# Altium project ROGO_ALFA_FULL_V2I2.PrjPcb
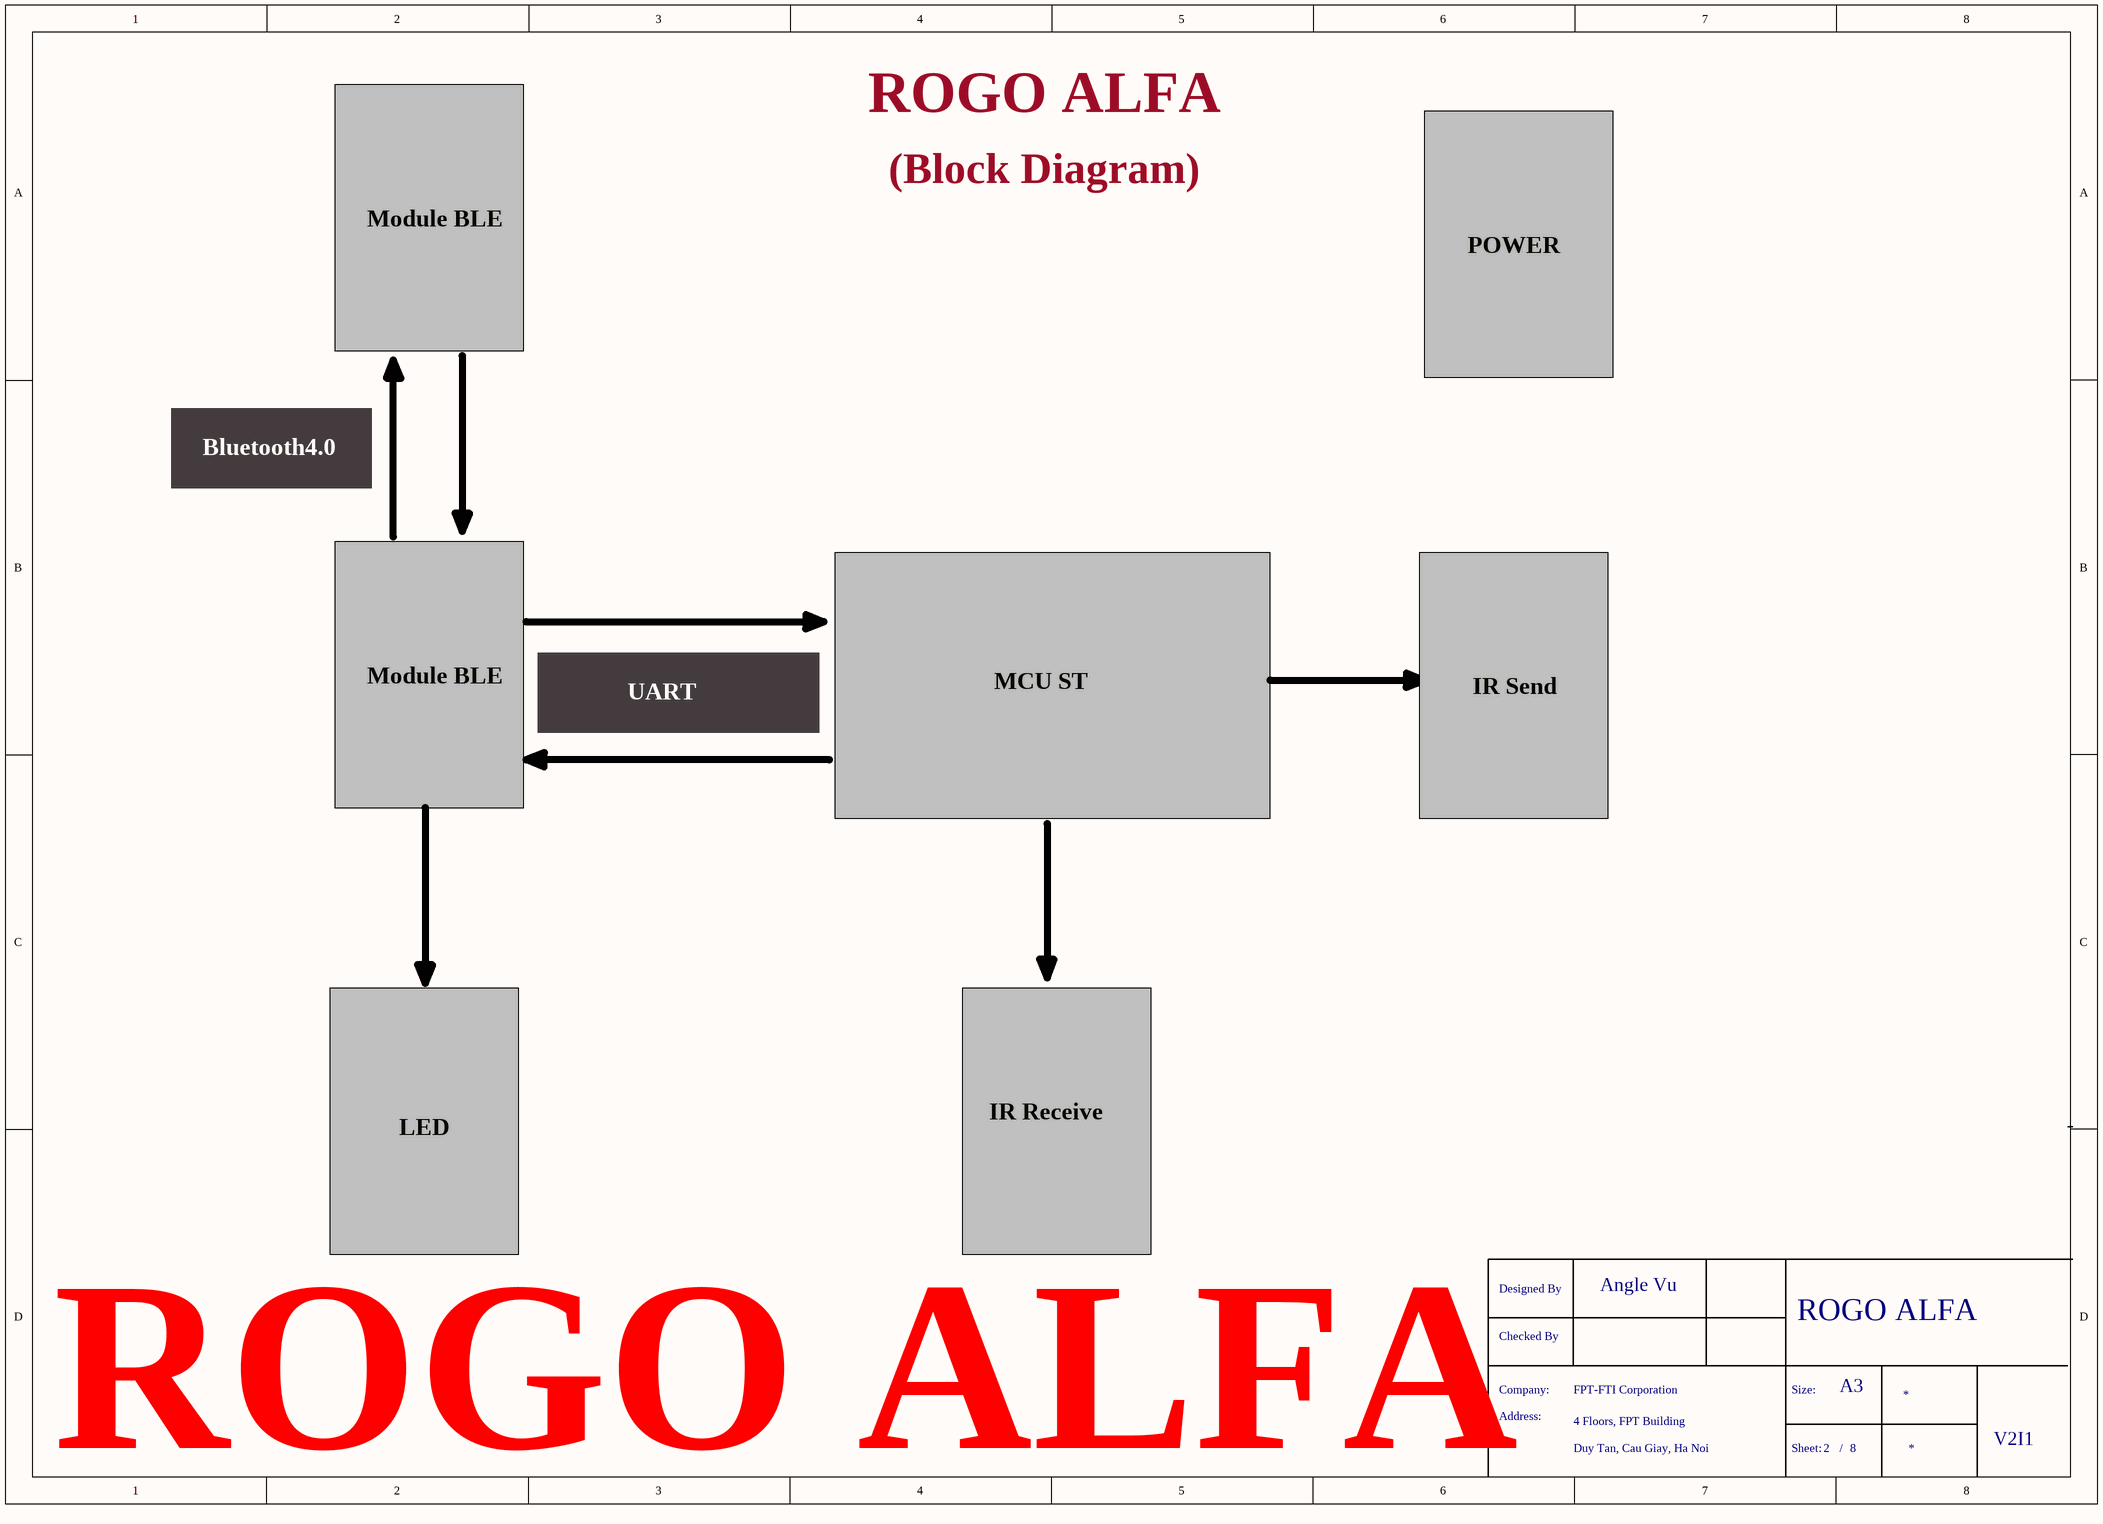
[diagram p0: [02] - BLOCK DIAGRAM.SchDoc]
addressName1: 4 Floors, FPT Building; addressName2: Duy Tan, Cau Giay, Ha Noi; CName: FPT-FTI Corporation; NameProject: ROGO ALFA; Version: V2I1
4 sheets, 54 parts. Net scope: flat (ports and power ports of the same name join across sheets).
Board file: ROGO_ALFA_FULL_PCB_V2I2 .PcbDoc
Sheets:
  [02] - BLOCK DIAGRAM.SchDoc
  [03] - MODULE BLE.SchDoc
  [05] - POWER.SchDoc
  [06] - PERIPHERAL.SchDoc

## Sheet [02] - BLOCK DIAGRAM.SchDoc
size A3; DocumentNumber: 2; SheetNumber: 2; SheetTotal: 8; NameAuthor: Angle Vu

### Notes on the sheet
- Module BLE
- (Block Diagram)
- POWER
- Bluetooth4.0
- UART
- MCU ST
- IR Send
- IR Receive
- LED
- CLOCKS (CPU & PCIE)
- ROGO ALFA
- Designed By
- Checked By
- Company:
- Size:
- A3
- Address:
- Sheet:
- /

## Sheet [03] - MODULE BLE.SchDoc
size A3; CompanyName: FPT-FTI copporation; Address1: FPT Building Duy Tan; Address2: Floor 4,; DocumentNumber: 3; SheetNumber: 3; SheetTotal: 8; NameAuthor: Angle Vu
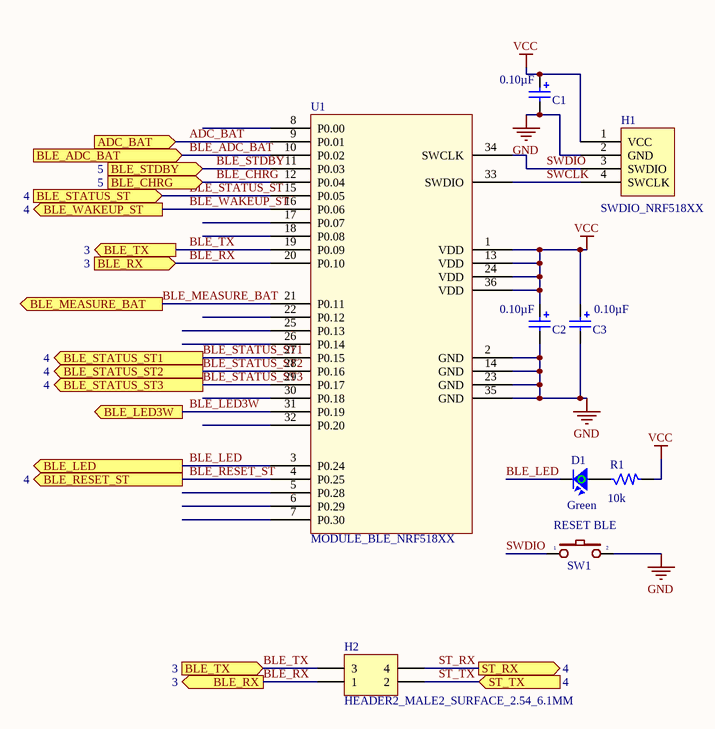
[diagram p1: [03] - MODULE BLE.SchDoc]

### Parts
C1  Capacitance: 0.10µF  [CAP_SMD0603]  (hidden comment: C_104_0603_CERAMIC_16V)
C2  Capacitance: 0.10µF  [CAP_SMD0603]  (hidden comment: C_104_0603_CERAMIC_16V)
C3  Capacitance: 0.10µF  [CAP_SMD0603]  (hidden comment: C_104_0603_CERAMIC_16V)
D1  Color: Green  [LED_GREEN_SMD0603]  (hidden comment: LED2_GREEN_0603_2V)
H1  SWDIO_NRF518XX  [HEADER4_ISP_NRF518xx_SUR1.27]
H2  HEADER2_MALE2_SURFACE_2.54_6.1MM  [HEADER2_MALE2_SUR2.54]
R1  Resistance (Ohms): 10k  [RES_SMD0603]  (hidden comment: R_10K_SMD0603_1%_1/10W)
SW1  RESET BLE  [SW2-SMD]
U1  MODULE_BLE_NRF518XX  [MODULE_NRF518xx]

### Ports
ADC_BAT (in), BLE_ADC_BAT (in), BLE_CHRG (in, see 5), BLE_LED3W (out), BLE_LED (out), BLE_MEASURE_BAT (out), BLE_RESET_ST (out, see 4), BLE_RX (in, see 3), BLE_RX (out, see 3), BLE_STATUS_ST1 (out, see 4), BLE_STATUS_ST2 (out, see 4), BLE_STATUS_ST3 (out, see 4), BLE_STATUS_ST (in, see 4), BLE_STDBY (in, see 5), BLE_TX (in, see 3), BLE_TX (out, see 3), BLE_WAKEUP_ST (out, see 4), ST_RX (out, see 4), ST_TX (in, see 4)

### Nets
GND: C1.2 C2.2 C3.2 H1.2(GND) SW1.2 U1.2(GND) U1.14(GND) U1.23(GND) U1.35(GND)
VCC: C1.1 C2.1 C3.1 H1.1(VCC) R1.2 U1.1(VDD) U1.13(VDD) U1.24(VDD) U1.36(VDD)
ADC_BAT: U1.9(P0.01) ; port ADC_BAT
BLE_ADC_BAT: U1.10(P0.02) ; port BLE_ADC_BAT
BLE_CHRG: U1.12(P0.04) ; port BLE_CHRG
BLE_LED: D1.2 U1.3(P0.24) ; port BLE_LED
BLE_LED3W: U1.31(P0.19) ; port BLE_LED3W
BLE_MEASURE_BAT: U1.21(P0.11) ; port BLE_MEASURE_BAT
BLE_RESET_ST: U1.4(P0.25) ; port BLE_RESET_ST
BLE_RX: H2.1 U1.20(P0.10) ; port BLE_RX
BLE_STATUS_ST: U1.15(P0.05) ; port BLE_STATUS_ST
BLE_STATUS_ST1: U1.27(P0.15) ; port BLE_STATUS_ST1
BLE_STATUS_ST2: U1.28(P0.16) ; port BLE_STATUS_ST2
BLE_STATUS_ST3: U1.29(P0.17) ; port BLE_STATUS_ST3
BLE_STDBY: U1.11(P0.03) ; port BLE_STDBY
BLE_TX: H2.3 U1.19(P0.09) ; port BLE_TX
BLE_WAKEUP_ST: U1.16(P0.06) ; port BLE_WAKEUP_ST
ST_RX: H2.4 ; port ST_RX
ST_TX: H2.2 ; port ST_TX
SWCLK: H1.4(SWCLK) U1.33(SWDIO)
SWDIO: H1.3(SWDIO) SW1.1 U1.34(SWCLK)
NetD1_1: D1.1 R1.1

Not connected (* = marked no-connect by the designer): U1 5(P0.28) 6(P0.29) 7(P0.30) 8(P0.00) 17(P0.07) 18(P0.08) 22(P0.12) 25(P0.13) 26(P0.14) 30(P0.18) 32(P0.20)

### Notes on the sheet
- Designed By
- Checked By
- Company:
- Size:
- A3
- Address:
- Sheet:
- /

### Library data of the parts
C1-C3 = C_104_0603_CERAMIC_16V: CAP CER 0.1UF 16V X7R 0603; Manufacturer: Murata Electronics North America; Manufacturer Part Number: GRM188R71C104KA01D; Tolerance: ±10%; Supplier 1: Digi-Key; RoHS: RoHS Compliant; Category: Capacitors; Stock 1: 3132000; Pricing 1: 4000=0.00359, 8000=0.00328, 12000=0.00312, 28000=0.00296, 100000=0.00215 (USD); Packaging: Tape & Reel (TR); Part Status: Active; Voltage - Rated: 16V; Temperature Coefficient: X7R; Mounting Type: Surface Mount, MLCC; Operating Temperature: -55°C ~ 125°C; Applications: General Purpose; Ratings: -; Package / Case: 0603 (1608 Metric); Size / Dimension: 0.063" L x 0.031" W (1.60mm x 0.80mm); Height - Seated (Max): -; Thickness (Max): 0.035" (0.90mm); Lead Spacing: -; Features: -; Lead Style: -; ComponentLink1URL: http://www.murata.com/~/media/webrenewal/support/library/catalog/products/capacitor/mlcc/c02e.pdf; ComponentLink1Description: http://www.murata.com/~/media/webrenewal/support/library/catalog/products/capacitor/mlcc/c02e.pdf; Supplier Part Number 1: 490-1532-2-ND
D1 = LED2_GREEN_0603_2V: LED GREEN CLEAR 0603 SMD; Manufacturer: Lite-On Inc.; Manufacturer Part Number: LTST-C191KGKT; Lens Color: Colorless; Millicandela Rating: 35mcd; Lens Style/Size: Rectangle with Flat Top, 1.10mm x 0.80mm; Voltage - Forward (Vf) (Typ): 2V; Current - Test: 20mA; Viewing Angle: 130°; Wavelength - Dominant: 571nm; Wavelength - Peak: 574nm; Supplier 1: Digi-Key; RoHS: RoHS Compliant; Category: Optoelectronics; Stock 1: 960000; Pricing 1: 5000=0.0404, 10000=0.03636, 25000=0.03232, 50000=0.02929, 125000=0.02727 (USD); Packaging: Tape & Reel (TR); Part Status: Active; Lens Transparency: Clear; Mounting Type: Surface Mount; Features: -; Package / Case: 0603 (1608 Metric); Supplier Device Package: *; Size / Dimension: 1.60mm L x 0.80mm W; Height (Max): 0.55mm; ComponentLink1URL: http://optoelectronics.liteon.com/upload/download/DS22-2000-228/S_110_LTST-C191KGKT.pdf; ComponentLink1Description: http://optoelectronics.liteon.com/upload/download/DS22-2000-228/S_110_LTST-C191KGKT.pdf; Supplier Part Number 1: 160-1446-2-ND
H1 = HEADER4_ISP_NRF518XX_HOLE_2.54: CONN HEADER 4POS .100 STR TIN; Manufacturer: Amphenol FCI; Manufacturer Part Number: 68002-404HLF; Connector Type: Header, Unshrouded; Number of Positions: 4; Number of Positions Loaded: All; Pitch: 0.100" (2.54mm); Supplier 1: Digi-Key; RoHS: RoHS Compliant; Category: Connectors, Interconnects; Stock 1: 5773; Pricing 1: 1=0.2, 10=0.186, 25=0.1588, 100=0.129, 250=0.11408, 500=0.10912, 1000=0.08928, 2500=0.08184, 5000=0.07936 (USD); Packaging: Bulk; Part Status: Active; Contact Type: Male Pin; Number of Rows: 1; Row Spacing: -; Contact Mating Length: 0.230" (5.84mm); Mounting Type: Through Hole; Termination: Solder; Fastening Type: -; Features: -; Contact Finish: Tin; Contact Finish Thickness: 100µin (2.54µm); Color: Black; ComponentLink1URL: http://portal.fciconnect.com/Comergent//fci/drawing/68000.pdf; ComponentLink1Description: http://portal.fciconnect.com/Comergent//fci/drawing/68000.pdf; Supplier Part Number 1: 609-3305-ND
H2 = HEADER2_MALE2_SURFACE_2.54_6.1MM: CONN HEADER 4POS TIN SMD; Manufacturer: Molex, LLC; Manufacturer Part Number: 0015912040; Connector Type: Header, Unshrouded, Breakaway; Number of Positions: 4; Number of Positions Loaded: All; Pitch: 0.100" (2.54mm); Supplier 1: Digi-Key; RoHS: RoHS Compliant; Category: Connectors, Interconnects; Stock 1: 10914; Pricing 1: 1=0.44, 10=0.42, 25=0.3596, 50=0.3058, 100=0.2938, 250=0.2638, 500=0.2518, 1000=0.20983, 2500=0.19184 (USD); Packaging: Bulk; Part Status: Active; Contact Type: Male Pin; Number of Rows: 2; Row Spacing: 0.100" (2.54mm); Contact Mating Length: 0.240" (6.10mm); Mounting Type: Surface Mount; Termination: Solder; Fastening Type: -; Features: -; Contact Finish: Tin; Contact Finish Thickness: 150µin (3.81µm); Color: Black; ComponentLink1URL: http://www.molex.com/pdm_docs/sd/015912040_sd.pdf; ComponentLink1Description: http://www.molex.com/pdm_docs/sd/015912040_sd.pdf; Supplier Part Number 1: WM9514-ND; ComponentLink2URL: http://www.te.com/commerce/DocumentDelivery/DDEController?Action=srchrtrv&DocNm=640456&DocType=Customer+Drawing&DocLang=English; ComponentLink2Description: http://www.te.com/commerce/DocumentDelivery/DDEController?Action=srchrtrv&DocNm=640456&DocType=Customer+Drawing&DocLang=English
R1 = R_10K_SMD0603_1%_1/10W: RES SMD 10K OHM 1% 1/10W 0603; Manufacturer: Yageo; Manufacturer Part Number: RC0603FR-0710KL; Power (Watts): 0.1W, 1/10W; Temperature Coefficient: ±100ppm/°C; Capacitance: 0.10µF; Voltage - Rated: 50V; Supplier 1: Digi-Key; RoHS: RoHS Compliant; Category: Resistors; Stock 1: 10005000; Pricing 1: 5000=0.00167, 10000=0.00145, 25000=0.00128, 50000=0.00117, 125000=0.00115 (USD); Packaging: Tape & Reel (TR); Part Status: Active; Tolerance: ±1%; Composition: Thick Film; Features: Moisture Resistant; Operating Temperature: -55°C ~ 155°C; Package / Case: 0603 (1608 Metric); Supplier Device Package: 0603; Size / Dimension: 0.063" L x 0.031" W (1.60mm x 0.80mm); Height: 0.022" (0.55mm); Number of Terminations: 2; ComponentLink1URL: http://www.yageo.com/documents/recent/PYu-RC_Group_51_RoHS_L_04.pdf; ComponentLink1Description: http://www.yageo.com/documents/recent/PYu-RC_Group_51_RoHS_L_04.pdf; Supplier Part Number 1: 311-10.0KHRTR-ND; Mounting Type: Surface Mount, MLCC; Applications: General Purpose; Ratings: -; Height - Seated (Max): -; Thickness (Max): 0.037" (0.94mm); Lead Spacing: -; Lead Style: -; ComponentLink2URL: http://datasheets.avx.com/X7RDielectric.pdf; ComponentLink2Description: http://datasheets.avx.com/X7RDielectric.pdf
SW1 = SW2_DPST_SURFACE_5MM: SWITCH TACTILE SPST-NO 0.05A 12V; Manufacturer: Wurth Electronics Inc; Manufacturer Part Number: 434121050836; Switch Function: Off-Mom; Contact Rating @ Voltage: 0.05A @ 12VDC; Actuator Type: Rectangular Button; Actuator Height off PCB, from Pins: 5.00mm; Actuator Orientation: Top Actuated; Outline: 6.00mm x 3.50mm; Illumination: Non-Illuminated; Operating Force: 360gf; Actuator Material: Liquid Crystal Polymer (LCP); Switch Travel: 0.25mm; Mechanical Life: 50,000 Cycles; Supplier 1: Digi-Key; RoHS: RoHS Compliant; Category: Switches; Stock 1: 0; Pricing 1: 1500=0.27 (USD); Packaging: Tape & Reel (TR); Part Status: Active; Circuit: SPST-NO; Mounting Type: Surface Mount; Termination Style: SMD (SMT) Tab; Illumination Voltage (Nominal): -; Illumination Type, Color: -; Ingress Protection: -; Features: -; Operating Temperature: -40°C ~ 85°C; ComponentLink1URL: http://katalog.we-online.de/em/datasheet/434121050836.pdf; ComponentLink1Description: http://katalog.we-online.de/em/datasheet/434121050836.pdf; Supplier Part Number 1: 732-7049-2-ND
U1 = MODULE_BLE_NRF518XX: PACKAGE: SURFACE_1.27MM; PIN: 36

## Sheet [05] - POWER.SchDoc
size A3; CompanyName: FPT-FTI copporation; Address1: FPT Building Duy Tan; Address2: Floor 4,; DocumentNumber: 5; SheetNumber: 5; SheetTotal: 8; NameAuthor: Angle Vu
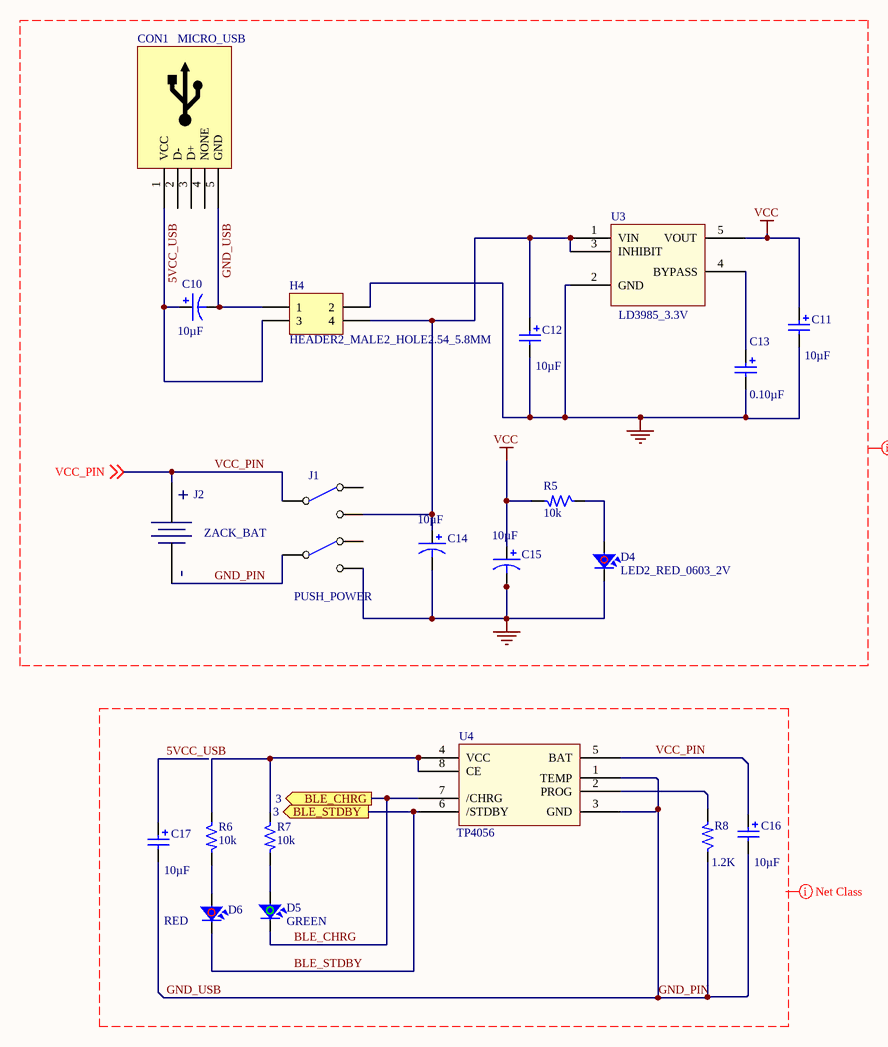
[diagram p2: [05] - POWER.SchDoc]

### Parts
C10  Capacitance: 10µF  [CAP_SMD0805 - TANTALUM]  (hidden comment: C_106_0805_TANTALUM_16V)
C11  Capacitance: 10µF  [CAP_SMD0805]  (hidden comment: C_106_0805_CERAMIC_16V)
C12  Capacitance: 10µF  [CAP_SMD0805]  (hidden comment: C_106_0805_CERAMIC_16V)
C13  Capacitance: 0.10µF  [CAP_SMD0603]  (hidden comment: C_104_0603_CERAMIC_16V)
C14  Capacitance: 10µF  [CAP_SMD1206_TANTALUM]  (hidden comment: C_106_1206_TANTALUM_25V)
C15  Capacitance: 10µF  [CAP_SMD1206_TANTALUM]  (hidden comment: C_106_1206_TANTALUM_25V)
C16  Capacitance: 10µF  [CAP_SMD0805]  (hidden comment: C_106_0805_CERAMIC_16V)
C17  Capacitance: 10µF  [CAP_SMD0805]  (hidden comment: C_106_0805_CERAMIC_16V)
CON1  MICRO_USB  [CON_MICRO_USB_HOLE]
D4  LED2_RED_0603_2V  [LED_RED_SMD0603]
D5  GREEN  [LED_GREEN_SMD0603]
D6  RED  [LED_RED_SMD0603]
H4  HEADER2_MALE2_HOLE2.54_5.8MM  [HEADER2_MALE2_HOLE2.54]
J1  PUSH_POWER  [SW6_DPDT_POWER]
J2  ZACK_BAT  [ZACK_BAT]
R5  Resistance (Ohms): 10k  [RES_SMD0603]  (hidden comment: R_10K_SMD0603_1%_1/10W)
R6  Resistance (Ohms): 10k  [RES_SMD0603]  (hidden comment: R_10K_SMD0603_1%_1/10W)
R7  Resistance (Ohms): 10k  [RES_SMD0603]  (hidden comment: R_10K_SMD0603_1%_1/10W)
R8  Resistance (Ohms): 1.2K  [RES_SMD0603]  (hidden comment: R_1K2_SMD0603_1%_1/10W)
U3  LD3985_3.3V  [POWER_LDO_LDR3985-3.3]
U4  TP4056  [POWER__CHARGE_TP4056]

### Ports
BLE_CHRG (out, see 3), BLE_STDBY (out, see 3)

### Nets
GND: C11.2 C12.2 C13.2 C14.2 C15.2 D4.2 H4.2 J1.4(NO) U3.2(GND)
VCC: C11.1 C15.1 R5.2 U3.5(VOUT)
VCC_PIN: C16.1 J1.2(COMMON) J2.1(+) U4.5(BAT) ; off-sheet VCC_PIN
5VCC_USB: C10.1 C17.1 CON1.1(VCC) H4.3
BLE_CHRG: D5.2 U4.7(/CHRG) ; port BLE_CHRG
BLE_STDBY: D6.2 U4.6(/STDBY) ; port BLE_STDBY
GND_PIN: C10.2 C16.2 C17.2 CON1.5(GND) H4.1 J1.5(COMMON) J2.2(-) R8.1 U4.1(TEMP) U4.3(GND)  [also labelled GND_USB]
NetC12_1: C12.1 C14.1 H4.4 J1.3(NO) U3.1(VIN) U3.3(INHIBIT)
NetC13_1: C13.1 U3.4(BYPASS)
NetD4_1: D4.1 R5.1
NetD5_1: D5.1 R7.2
NetD6_1: D6.1 R6.2
NetR6_1: R6.1 R7.1 U4.4(VCC) U4.8(CE)
NetR8_2: R8.2 U4.2(PROG)

Not connected (* = marked no-connect by the designer): CON1 2(D-) 3(D+) 4(NONE); J1 1(NC) 6(NC)

### Layout directives
power charge: Undefined: 5VCC_USB, BLE_CHRG, BLE_STDBY, GND_PIN, GND_USB, VCC_PIN
power supply: Undefined: 5VCC_USB, GND, GND_PIN, GND_USB, VCC, VCC_PIN

### Notes on the sheet
- Designed By
- Checked By
- Company:
- Size:
- A3
- Address:
- Sheet:
- /

### Library data of the parts
C10 = C_106_0805_TANTALUM_16V: CAP TANT 10UF 16V 10% 0805; Manufacturer: AVX Corporation; Manufacturer Part Number: TPCR106K016R1800; Manufacturer Size Code: R; ESR (Equivalent Series Resistance): 1.8 Ohm; Type: Molded; Supplier 1: Digi-Key; RoHS: RoHS Compliant; Category: Capacitors; Stock 1: 7500; Pricing 1: 2500=1.404, 5000=1.377, 12500=1.3392, 25000=1.323, 62500=1.296 (USD); Packaging: Tape & Reel (TR); Part Status: Active; Tolerance: ±10%; Voltage - Rated: 16V; Operating Temperature: -55°C ~ 125°C; Mounting Type: Surface Mount; Package / Case: 0805 (2012 Metric); Size / Dimension: 0.079" L x 0.053" W (2.00mm x 1.35mm); Height - Seated (Max): 0.059" (1.50mm); Lead Spacing: -; Features: General Purpose; Lifetime @ Temp.: -; ComponentLink1URL: http://datasheets.avx.com/TPC.pdf; ComponentLink1Description: http://datasheets.avx.com/TPC.pdf; Supplier Part Number 1: 478-9014-2-ND
C11 C12 C16 C17 = C_106_0805_CERAMIC_16V: CAP CER 10UF 16V X5R 0805; Manufacturer: Murata Electronics North America; Manufacturer Part Number: GRM21BR61C106KE15K; Tolerance: ±10%; Supplier 1: Digi-Key; RoHS: RoHS Compliant; Category: Capacitors; Stock 1: 106329; Pricing 1: 1=0.19, 10=0.13, 50=0.0748, 100=0.0618, 250=0.052, 500=0.04356, 1000=0.03575, 5000=0.03023 (USD); Packaging: Cut Tape (CT); Part Status: Active; Voltage - Rated: 16V; Temperature Coefficient: X5R; Mounting Type: Surface Mount, MLCC; Operating Temperature: -55°C ~ 85°C; Applications: General Purpose; Ratings: -; Package / Case: 0805 (2012 Metric); Size / Dimension: 0.079" L x 0.049" W (2.00mm x 1.25mm); Height - Seated (Max): -; Thickness (Max): 0.053" (1.35mm); Lead Spacing: -; Features: -; Lead Style: -; ComponentLink1URL: http://www.murata.com/~/media/webrenewal/support/library/catalog/products/capacitor/mlcc/c02e.pdf; ComponentLink1Description: http://www.murata.com/~/media/webrenewal/support/library/catalog/products/capacitor/mlcc/c02e.pdf; Supplier Part Number 1: 490-6473-1-ND
C13 = C_104_0603_CERAMIC_16V: as C1 on sheet [03] - MODULE BLE; Supplier 1: Digi-Key; RoHS: RoHS Compliant; Category: Capacitors; Stock 1: 3132000; Pricing 1: 4000=0.00359, 8000=0.00328, 12000=0.00312, 28000=0.00296, 100000=0.00215 (USD); Packaging: Tape & Reel (TR); Part Status: Active; Voltage - Rated: 16V; Temperature Coefficient: X7R; Mounting Type: Surface Mount, MLCC; Operating Temperature: -55°C ~ 125°C; Applications: General Purpose; Ratings: -; Package / Case: 0603 (1608 Metric); Size / Dimension: 0.063" L x 0.031" W (1.60mm x 0.80mm); Height - Seated (Max): -; Thickness (Max): 0.035" (0.90mm); Lead Spacing: -; Features: -; Lead Style: -; ComponentLink1URL: http://www.murata.com/~/media/webrenewal/support/library/catalog/products/capacitor/mlcc/c02e.pdf; ComponentLink1Description: http://www.murata.com/~/media/webrenewal/support/library/catalog/products/capacitor/mlcc/c02e.pdf; Supplier Part Number 1: 490-1532-2-ND
C14 C15 = C_106_1206_TANTALUM_25V: CAP TANT 10UF 25V 10% 1206; Manufacturer: AVX Corporation; Manufacturer Part Number: F951E106KAAAQ2; Manufacturer Size Code: A; ESR (Equivalent Series Resistance): 2 Ohm; Type: Conformal Coated; Supplier 1: Digi-Key; RoHS: RoHS Compliant; Category: Capacitors; Stock 1: 2500; Pricing 1: 2500=0.31132, 5000=0.29521, 12500=0.27975, 25000=0.27374, 62500=0.27009, 125000=0.26043 (USD); Packaging: Tape & Reel (TR); Part Status: Active; Tolerance: ±10%; Voltage - Rated: 25V; Operating Temperature: -55°C ~ 125°C; Mounting Type: Surface Mount; Package / Case: 1206 (3216 Metric); Size / Dimension: 0.126" L x 0.067" W (3.20mm x 1.70mm); Height - Seated (Max): 0.063" (1.60mm); Lead Spacing: -; Features: General Purpose; Lifetime @ Temp.: -; ComponentLink1URL: http://datasheets.avx.com/f95.pdf; ComponentLink1Description: http://datasheets.avx.com/f95.pdf; Supplier Part Number 1: 478-8494-2-ND
CON1 = CONNECT_MICRO_USB_SURFACE: CONN RCPT STD MICRO USB TYPE B; Manufacturer: Amphenol FCI; Manufacturer Part Number: 10103593-0001LF; Connector Type: USB - micro B; Number of Contacts: 5; Gender: Receptacle; Specifications: USB 2.0; Regulator Topology: Positive Fixed; Voltage - Output: 3.3V; Current - Output: 150mA; Voltage - Dropout (Typical): 0.06V @ 150mA; Number of Regulators: 1; Voltage - Input: Up to 6V; Current - Limit (Min): 300mA; RoHS: RoHS Compliant; Category: Connectors, Interconnects; Packaging: Digi-Reel®; Part Status: Active; Mounting Type: Board Cutout, Surface Mount, Right Angle; Features: Shielded, Solder Retention; Ingress Protection: -; ComponentLink1URL: http://portal.fciconnect.com/Comergent//fci/drawing/10103593.pdf; ComponentLink1Description: http://portal.fciconnect.com/Comergent//fci/drawing/10103593.pdf; Operating Temperature: -40°C ~ 125°C; Package / Case: SC-74A, SOT-753; Supplier Device Package: SOT-23-5; ComponentLink2URL: http://www.st.com/web/en/resource/technical/document/datasheet/CD00003395.pdf; ComponentLink2Description: http://www.st.com/web/en/resource/technical/document/datasheet/CD00003395.pdf; Supplier 1: Digi-Key; Stock 1: 4000; Pricing 1: 1000=0.36878, 2000=0.3576, 3000=0.33525, 5000=0.32408, 10000=0.30173, 25000=0.29055 (USD); Supplier Part Number 1: 609-4049-2-ND
D4 D6 = LED2_RED_0603_2V: LED RED CLEAR 0603 SMD; Manufacturer: Lite-On Inc.; Manufacturer Part Number: LTST-C191KRKT; Lens Color: Colorless; Millicandela Rating: 54mcd; Lens Style/Size: Rectangle with Flat Top, 1.10mm x 0.80mm; Voltage - Forward (Vf) (Typ): 2V; Current - Test: 20mA; Viewing Angle: 130°; Wavelength - Dominant: 631nm; Wavelength - Peak: 639nm; Supplier 1: Digi-Key; RoHS: RoHS Compliant; Category: Optoelectronics; Stock 1: 680000; Pricing 1: 5000=0.0404, 10000=0.03636, 25000=0.03232, 50000=0.02929, 125000=0.02727 (USD); Packaging: Tape & Reel (TR); Part Status: Active; Color: Red; Lens Transparency: Clear; Mounting Type: Surface Mount; Features: -; Package / Case: 0603 (1608 Metric); Supplier Device Package: *; Size / Dimension: 1.60mm L x 0.80mm W; Height (Max): 0.55mm; ComponentLink1URL: http://optoelectronics.liteon.com/upload/download/DS22-2000-223/S_110_LTST-C191KRKT.pdf; ComponentLink1Description: http://optoelectronics.liteon.com/upload/download/DS22-2000-223/S_110_LTST-C191KRKT.pdf; Supplier Part Number 1: 160-1447-2-ND
D5 = LED2_GREEN_0603_2V: as D1 on sheet [03] - MODULE BLE; Supplier 1: Digi-Key; RoHS: RoHS Compliant; Category: Optoelectronics; Stock 1: 960000; Pricing 1: 5000=0.0404, 10000=0.03636, 25000=0.03232, 50000=0.02929, 125000=0.02727 (USD); Packaging: Tape & Reel (TR); Part Status: Active; Color: Green; Lens Transparency: Clear; Mounting Type: Surface Mount; Features: -; Package / Case: 0603 (1608 Metric); Supplier Device Package: *; Size / Dimension: 1.60mm L x 0.80mm W; Height (Max): 0.55mm; ComponentLink1URL: http://optoelectronics.liteon.com/upload/download/DS22-2000-228/S_110_LTST-C191KGKT.pdf; ComponentLink1Description: http://optoelectronics.liteon.com/upload/download/DS22-2000-228/S_110_LTST-C191KGKT.pdf; Supplier Part Number 1: 160-1446-2-ND
H4 = HEADER2_MALE2_HOLE2.54_5.8MM: 02+02 DIL VERT PIN HDR; Manufacturer: Harwin Inc.; Manufacturer Part Number: M20-9760246; Connector Type: Header, Unshrouded, Breakaway; Number of Positions: 4; Number of Positions Loaded: All; Pitch: 0.100" (2.54mm); Supplier 1: Digi-Key; RoHS: RoHS Compliant; Category: Connectors, Interconnects; Stock 1: 1640; Pricing 1: 1=0.11, 10=0.097, 100=0.0798, 500=0.06308, 1000=0.05415, 5000=0.0494, 10000=0.0475 (USD); Packaging: Bulk; Part Status: Active; Contact Type: Male Pin; Number of Rows: 2; Row Spacing: 0.100" (2.54mm); Contact Mating Length: 0.228" (5.80mm); Mounting Type: Through Hole; Termination: Solder; Fastening Type: -; Features: -; Contact Finish: Tin; Contact Finish Thickness: -; Color: Black; ComponentLink1URL: http://cdn.harwin.com/pdfs/M20-976.pdf; ComponentLink1Description: http://cdn.harwin.com/pdfs/M20-976.pdf; Supplier Part Number 1: 952-1772-ND
J1 = SW6_DPDT_HOLE_PUSH_0.1A_30A: SWITCH PUSH DPDT 0.1A 30V; Manufacturer: Apem Inc.; Manufacturer Part Number: MHPS2266; Switch Function: On-On; Current Rating: 100mA (DC); Actuator Type: Plunger for Cap; Electrical Life: 10,000 Cycles; Supplier 1: Digi-Key; RoHS: RoHS Compliant; Category: Switches; Stock 1: 2279; Pricing 1: 1=1.33, 10=1.243, 25=1.184, 50=1.1248, 100=1.0952, 250=1.0656, 500=1.0064, 1000=0.9472, 2500=0.8584 (USD); Packaging: Bulk; Part Status: Active; Type: Keyswitch; Circuit: DPDT; Voltage Rating - AC: -; Voltage Rating - DC: 30V; Color - Actuator/Cap: -; Illumination Type, Color: -; Illumination Voltage (Nominal): -; Mounting Type: Through Hole; Termination Style: PC Pin; Ingress Protection: -; Features: -; Panel Cutout Dimensions: -; Operating Temperature: -20°C ~ 65°C; Mechanical Life: -; ComponentLink1URL: http://www.apem.com/files/apem/brochures/MHPS_Q42014.pdf; ComponentLink1Description: http://www.apem.com/files/apem/brochures/MHPS_Q42014.pdf; Supplier Part Number 1: 679-3528-ND
J2 = ZACK2_HOLE_BATTERY_LOCK: CONN HEADER VERT 2POS .100 TIN; Manufacturer: TE Connectivity AMP Connectors; Manufacturer Part Number: 640456-2; Connector Type: Header, Unshrouded; Number of Positions: 2; Number of Positions Loaded: All; Pitch: 0.100" (2.54mm); Supplier 1: Digi-Key; RoHS: RoHS Compliant; Category: Connectors, Interconnects; Stock 1: 136186; Pricing 1: 1=0.12, 10=0.083, 100=0.069, 500=0.066, 1000=0.058, 2000=0.052, 5000=0.05, 10000=0.041 (USD); Packaging: Bulk; Part Status: Active; Contact Type: Male Pin; Number of Rows: 1; Row Spacing: -; Contact Mating Length: 0.295" (7.49mm); Mounting Type: Through Hole; Termination: Solder; Fastening Type: Friction Lock; Features: -; Contact Finish: Tin; Contact Finish Thickness: -; Color: Natural; ComponentLink1URL: http://www.te.com/commerce/DocumentDelivery/DDEController?Action=srchrtrv&DocNm=640456&DocType=Customer+Drawing&DocLang=English; ComponentLink1Description: http://www.te.com/commerce/DocumentDelivery/DDEController?Action=srchrtrv&DocNm=640456&DocType=Customer+Drawing&DocLang=English; Supplier Part Number 1: A1921-ND
R5-R7 = R_10K_SMD0603_1%_1/10W: as R1 on sheet [03] - MODULE BLE; Supplier 1: Digi-Key; RoHS: RoHS Compliant; Category: Resistors; Stock 1: 10005000; Pricing 1: 5000=0.00167, 10000=0.00145, 25000=0.00128, 50000=0.00117, 125000=0.00115 (USD); Packaging: Tape & Reel (TR); Part Status: Active; Tolerance: ±1%; Composition: Thick Film; Features: Moisture Resistant; Operating Temperature: -55°C ~ 155°C; Package / Case: 0603 (1608 Metric); Supplier Device Package: 0603; Size / Dimension: 0.063" L x 0.031" W (1.60mm x 0.80mm); Height: 0.022" (0.55mm); Number of Terminations: 2; ComponentLink1URL: http://www.yageo.com/documents/recent/PYu-RC_Group_51_RoHS_L_04.pdf; ComponentLink1Description: http://www.yageo.com/documents/recent/PYu-RC_Group_51_RoHS_L_04.pdf; Supplier Part Number 1: 311-10.0KHRTR-ND; Mounting Type: Surface Mount, MLCC; Applications: General Purpose; Ratings: -; Height - Seated (Max): -; Thickness (Max): 0.037" (0.94mm); Lead Spacing: -; Lead Style: -; ComponentLink2URL: http://datasheets.avx.com/X7RDielectric.pdf; ComponentLink2Description: http://datasheets.avx.com/X7RDielectric.pdf
R8 = R_1K2_SMD0603_1%_1/10W: RES SMD 1.2K OHM 1% 1/10W 0603; Manufacturer: Yageo; Manufacturer Part Number: RC0603FR-071K2L; Power (Watts): 0.1W, 1/10W; Temperature Coefficient: ±100ppm/°C; Supplier 1: Digi-Key; RoHS: RoHS Compliant; Category: Resistors; Stock 1: 560000; Pricing 1: 5000=0.00167, 10000=0.00145, 25000=0.00128, 50000=0.00117, 125000=0.00115 (USD); Packaging: Tape & Reel (TR); Part Status: Active; Tolerance: ±1%; Composition: Thick Film; Features: Moisture Resistant; Operating Temperature: -55°C ~ 155°C; Package / Case: 0603 (1608 Metric); Supplier Device Package: 0603; Size / Dimension: 0.063" L x 0.031" W (1.60mm x 0.80mm); Height: 0.022" (0.55mm); Number of Terminations: 2; ComponentLink1URL: http://www.yageo.com/documents/recent/PYu-RC_Group_51_RoHS_L_04.pdf; ComponentLink1Description: http://www.yageo.com/documents/recent/PYu-RC_Group_51_RoHS_L_04.pdf; Supplier Part Number 1: 311-1.20KHRTR-ND
U3 = POWER_LDO_LD3985_3.3V_SOT-23-5: IC REG LDO 3.3V 0.15A SOT23-5; Manufacturer: STMicroelectronics; Manufacturer Part Number: LD3985M33R; Regulator Topology: Positive Fixed; Current - Output: 150mA; Voltage - Dropout (Typical): 0.06V @ 150mA; Number of Regulators: 1; Voltage - Input: Up to 6V; Current - Limit (Min): 300mA; Supplier 1: Digi-Key; RoHS: RoHS Compliant; Category: Integrated Circuits (ICs); Stock 1: 6000; Pricing 1: 3000=0.2294, 6000=0.2146, 15000=0.1998, 30000=0.18944, 75000=0.185, 150000=0.1776 (USD); Packaging: Tape & Reel (TR); Part Status: Active; Voltage - Output: 3.3V; Operating Temperature: -40°C ~ 125°C; Mounting Type: Surface Mount; Package / Case: SC-74A, SOT-753; Supplier Device Package: SOT-23-5; ComponentLink1URL: http://www.st.com/web/en/resource/technical/document/datasheet/CD00003395.pdf; ComponentLink1Description: http://www.st.com/web/en/resource/technical/document/datasheet/CD00003395.pdf; Supplier Part Number 1: 497-3504-2-ND
U4 = POWER_CHARGE_TP4056_4.2V_SOP8: IC CHARGR BATTERY L-ION  SOP8; Manufacturer: NanJing; Battery Chemistry: Lithium-Ion; Number of Cells: 1; Current - Charging: Constant - Programmable; Programmable Features: Timer; Fault Protection: Over Current, Over Temperature; Charge Current - Max: 700mA; Battery Pack Voltage: 4.2V; Voltage - Supply (Max): 8V; Supply: TAOBAO; Manufacturer Part Number: TP4056; RoHS: RoHS Compliant; Category: Integrated Circuits (ICs); Stock 1: 0; Pricing 1: 500=1.76 (USD); Packaging: Tape & Reel (TR); Part Status: Active; Interface: -; Operating Temperature: -40°C ~ 85°C (TA); Package / Case: SOP8; Supplier Device Package: SOP8; ComponentLink1URL: http://www.linear.com/docs/3854; ComponentLink1Description: http://www.linear.com/docs/3854

## Sheet [06] - PERIPHERAL.SchDoc
size A3; CompanyName: FPT-FTI copporation; Address1: FPT Building Duy Tan; Address2: Floor 4,; DocumentNumber: 6; SheetNumber: 6; SheetTotal: 8; NameAuthor: Angle Vu
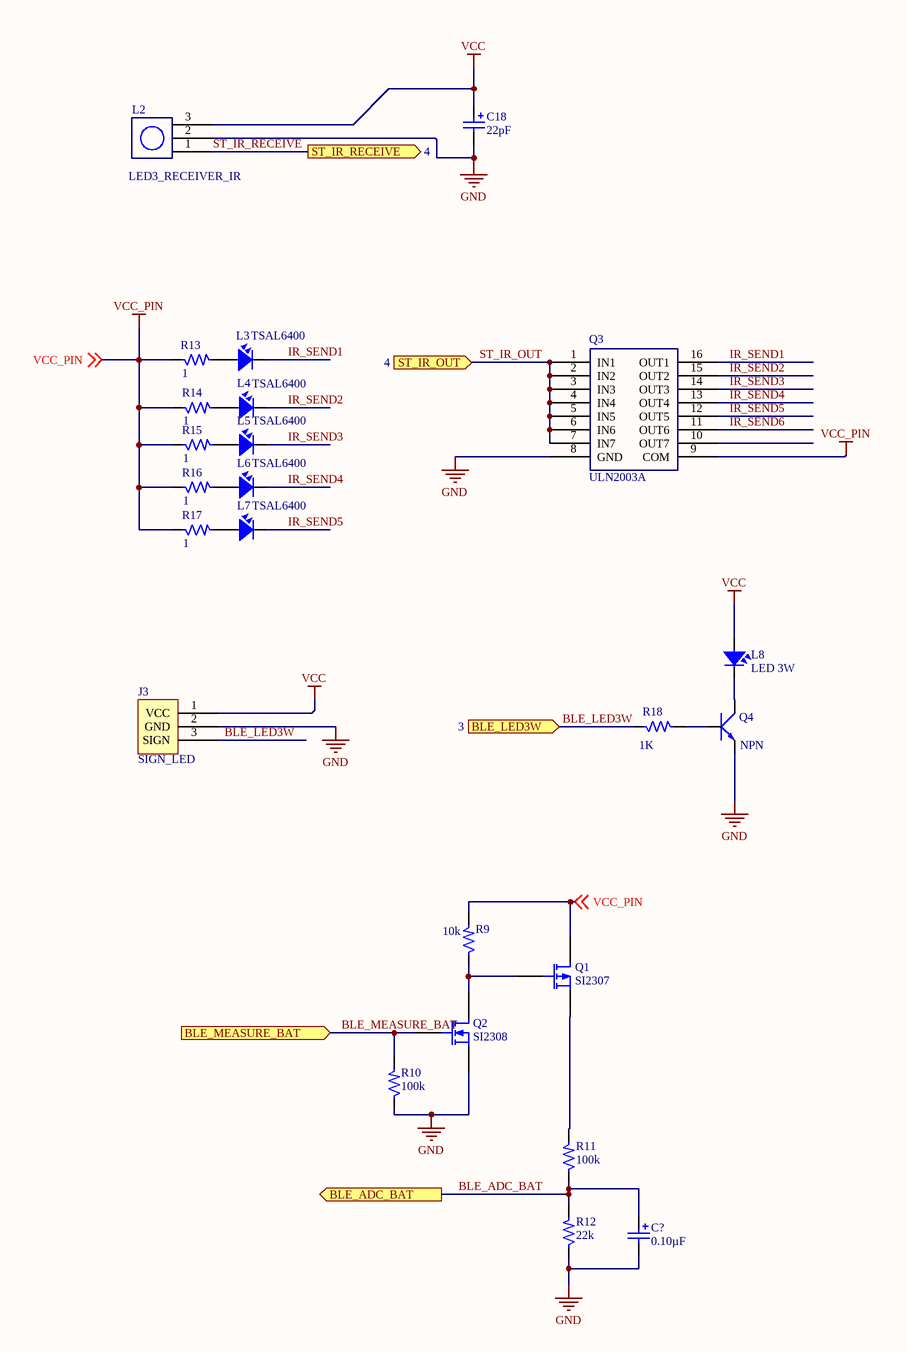
[diagram p3: [06] - PERIPHERAL.SchDoc]

### Parts
C18  Capacitance: 22pF  [CAP_SMD0603]  (hidden comment: C_22pF_SMD0603_CERAMIC_50V)
C19  Capacitance: 0.10µF  [CAP_SMD0603]  (hidden comment: C_104_0603_CERAMIC_16V)
J3  SIGN_LED  [HEADER3_SIGN_LED]
L2  LED3_RECEIVER_IR  [LED3_IR_RECEIVER]
L3  TSAL6400  [LED2_IR_TRANSMITOR]
L4  TSAL6400  [LED2_IR_TRANSMITOR]
L5  TSAL6400  [LED2_IR_TRANSMITOR]
L6  TSAL6400  [LED2_IR_TRANSMITOR]
L7  TSAL6400  [LED2_IR_TRANSMITOR]
L8  LED 3W  [LED2_IR_TRANSMITOR]
Q1  SI2307  [TRAN-PNP-SMD]
Q2  SI2308  [TRAN-NPN-SMD]
Q3  ULN2003A  [TRAN7_ULN2003_16SOIC]
Q4  NPN  [TRAN-NPN-SMD]
R9  Resistance (Ohms): 10k  [RES_SMD0603]  (hidden comment: R_10K_SMD0603_1%_1/10W)
R10  Resistance (Ohms): 100k  [RES_SMD0603]  (hidden comment: R_100K_SMD0603_1%_1/10W)
R11  Resistance (Ohms): 100k  [RES_SMD0603]  (hidden comment: R_100K_SMD0603_1%_1/10W)
R12  Resistance (Ohms): 22k  (hidden comment: R_22K_SMD0603_1%_1/10W)
R13  Resistance (Ohms): 1  [RES_SMD0603]  (hidden comment: R_1OhM_SMD0603_1%_1/4W)
R14  Resistance (Ohms): 1  [RES_SMD0603]  (hidden comment: R_1OhM_SMD0603_1%_1/4W)
R15  Resistance (Ohms): 1  [RES_SMD0603]  (hidden comment: R_1OhM_SMD0603_1%_1/4W)
R16  Resistance (Ohms): 1  [RES_SMD0603]  (hidden comment: R_1OhM_SMD0603_1%_1/4W)
R17  Resistance (Ohms): 1  [RES_SMD0603]  (hidden comment: R_1OhM_SMD0603_1%_1/4W)
R18  Resistance (Ohms): 1K  [RES_SMD0603]  (hidden comment: R_1K_SMD0603_1%_1/10W)

### Ports
BLE_ADC_BAT (out), BLE_LED3W (in, see 3), BLE_MEASURE_BAT (in), ST_IR_OUT (in, see 4), ST_IR_RECEIVE (out, see 4)

### Nets
GND: C18.2 C19.2 J3.2(GND) L2.2(GND) Q2.2(S) Q3.8(GND) Q4.2(E) R10.1 R12.1
VCC: C18.1 J3.1(VCC) L2.3(VCC) L8.1
VCC_PIN: Q1.3(D) Q3.9(COM) R9.2 R13.1 R14.1 R15.1 R16.1 R17.1 ; off-sheet VCC_PIN
BLE_ADC_BAT: C19.1 R11.1 R12.2 ; port BLE_ADC_BAT
BLE_LED3W: J3.3(SIGN) R18.1 ; port BLE_LED3W
BLE_MEASURE_BAT: Q2.1(G) R10.2 ; port BLE_MEASURE_BAT
IR_SEND1: L3.2 Q3.16(OUT1)
IR_SEND2: L4.2 Q3.15(OUT2)
IR_SEND3: L5.2 Q3.14(OUT3)
IR_SEND4: L6.2 Q3.13(OUT4)
IR_SEND5: L7.2 Q3.12(OUT5)
IR_SEND6: Q3.11(OUT6)
ST_IR_OUT: Q3.1(IN1) Q3.2(IN2) Q3.3(IN3) Q3.4(IN4) Q3.5(IN5) Q3.6(IN6) Q3.7(IN7) ; port ST_IR_OUT
ST_IR_RECEIVE: L2.1(OUT) ; port ST_IR_RECEIVE
NetL3_1: L3.1 R13.2
NetL4_1: L4.1 R14.2
NetL5_1: L5.1 R15.2
NetL6_1: L6.1 R16.2
NetL7_1: L7.1 R17.2
NetL8_2: L8.2 Q4.3(C)
NetQ1_1: Q1.1(G) Q2.3(D) R9.1
NetQ1_2: Q1.2(S) R11.2
NetQ4_1: Q4.1(B) R18.2

Not connected (* = marked no-connect by the designer): Q3 10(OUT7)

### Notes on the sheet
- Designed By
- Checked By
- Company:
- Size:
- A3
- Address:
- Sheet:
- /

### Library data of the parts
C18 = C_22pF_SMD0603_CERAMIC_50V: CAP CER 22PF 50V NP0 0603; Manufacturer: Murata Electronics North America; Manufacturer Part Number: GQM1885C1H220JB01D; Tolerance: ±5%; Temperature Coefficient: C0G, NP0; Supplier 1: Digi-Key; RoHS: RoHS Compliant; Category: Capacitors; Stock 1: 40000; Pricing 1: 4000=0.168, 8000=0.1568, 12000=0.154, 28000=0.1512, 100000=0.14 (USD); Packaging: Tape & Reel (TR); Part Status: Active; Voltage - Rated: 50V; Mounting Type: Surface Mount, MLCC; Operating Temperature: -55°C ~ 125°C; Applications: RF, Microwave, High Frequency; Ratings: -; Package / Case: 0603 (1608 Metric); Size / Dimension: 0.063" L x 0.031" W (1.60mm x 0.80mm); Height - Seated (Max): -; Thickness (Max): 0.035" (0.90mm); Lead Spacing: -; Features: High Q, Low Loss; Lead Style: -; ComponentLink1URL: http://www.murata.com/~/media/webrenewal/support/library/catalog/products/capacitor/mlcc/c02e.pdf; ComponentLink1Description: http://www.murata.com/~/media/webrenewal/support/library/catalog/products/capacitor/mlcc/c02e.pdf; Supplier Part Number 1: 490-3575-2-ND
C19 = C_104_0603_CERAMIC_16V: as C1 on sheet [03] - MODULE BLE; Supplier 1: Digi-Key; RoHS: RoHS Compliant; Category: Capacitors; Stock 1: 3132000; Pricing 1: 4000=0.00359, 8000=0.00328, 12000=0.00312, 28000=0.00296, 100000=0.00215 (USD); Packaging: Tape & Reel (TR); Part Status: Active; Voltage - Rated: 16V; Temperature Coefficient: X7R; Mounting Type: Surface Mount, MLCC; Operating Temperature: -55°C ~ 125°C; Applications: General Purpose; Ratings: -; Package / Case: 0603 (1608 Metric); Size / Dimension: 0.063" L x 0.031" W (1.60mm x 0.80mm); Height - Seated (Max): -; Thickness (Max): 0.035" (0.90mm); Lead Spacing: -; Features: -; Lead Style: -; ComponentLink1URL: http://www.murata.com/~/media/webrenewal/support/library/catalog/products/capacitor/mlcc/c02e.pdf; ComponentLink1Description: http://www.murata.com/~/media/webrenewal/support/library/catalog/products/capacitor/mlcc/c02e.pdf; Supplier Part Number 1: 490-1532-2-ND
J3 = HEADER3_SIGN_LED_HOLE2.54: CONN HEADER VERT 3POS .100 TIN; Manufacturer: TE Connectivity AMP Connectors; Manufacturer Part Number: 640456-3; Connector Type: Header, Unshrouded; Number of Positions: 3; Number of Positions Loaded: All; Pitch: 0.100" (2.54mm); Supplier 1: Digi-Key; RoHS: RoHS Compliant; Category: Connectors, Interconnects; Stock 1: 100299; Pricing 1: 1=0.13, 10=0.119, 100=0.095, 500=0.088, 1000=0.081, 2000=0.075, 5000=0.07, 10000=0.056, 25000=0.052 (USD); Packaging: Bulk; Part Status: Active; Contact Type: Male Pin; Number of Rows: 1; Row Spacing: -; Contact Mating Length: 0.295" (7.49mm); Mounting Type: Through Hole; Termination: Solder; Fastening Type: Friction Lock; Features: -; Contact Finish: Tin; Contact Finish Thickness: -; Color: Natural; ComponentLink1URL: http://www.te.com/commerce/DocumentDelivery/DDEController?Action=srchrtrv&DocNm=640456&DocType=Customer+Drawing&DocLang=English; ComponentLink1Description: http://www.te.com/commerce/DocumentDelivery/DDEController?Action=srchrtrv&DocNm=640456&DocType=Customer+Drawing&DocLang=English; Supplier Part Number 1: A19470-ND
L2 = LED3_RECEIVER_IR_HOLE_38KHz_3V: RECEIVER IR REM CTRL 3V 38KHZ; Manufacturer: Sharp Microelectronics; Manufacturer Part Number: GP1UE261XKVF; Sensing Distance: 10m; B.P.F. Center Frequency: 38.0kHz; Voltage - Supply: 2.7 V ~ 5.5 V; Current - Supply: 400µA; Supplier 1: Digi-Key; RoHS: RoHS Compliant; Category: Sensors, Transducers; Stock 1: 4398; Pricing 1: 1=1.3, 10=1.053, 25=0.81, 100=0.729, 250=0.648, 500=0.5508, 1000=0.4536, 2500=0.432 (USD); Part Status: Active; Orientation: Top View; Mounting Type: Through Hole; Operating Temperature: -10°C ~ 70°C (TA); ComponentLink1URL: http://www.sharpsma.com/ru/download/GP1UE26XK0VF-Epdf; ComponentLink1Description: http://www.sharpsma.com/ru/download/GP1UE26XK0VF-Epdf; Supplier Part Number 1: 425-2883-ND
L3-L8 = LED2_TRANSMITER_IR_TSAL6400_HOLE_5MM: EMITTER IR 940NM 100MA RADIAL; Manufacturer: Vishay Semiconductor Opto Division; Type: Infrared (IR); Radiant Intensity (Ie) Min @ If: 25mW/sr @ 100mA; Voltage - Forward (Vf) (Typ): 1.35V; Viewing Angle: 50°; Supplier 1: Digi-Key; Manufacturer Part Number: TSAL6400; RoHS: RoHS Compliant; Category: Optoelectronics; Stock 1: 12590; Pricing 1: 1=0.57, 10=0.412, 25=0.336, 100=0.2688, 250=0.2268, 500=0.1932, 1000=0.1512, 2500=0.1386, 5000=0.126 (USD); Packaging: Bulk; Part Status: Active; Current - DC Forward (If) (Max): 100mA; Wavelength: 940nm; Orientation: Top View; Operating Temperature: -40°C ~ 85°C (TA); Mounting Type: Through Hole; Package / Case: Radial, 5mm Dia (T 1 3/4); ComponentLink1URL: http://www.vishay.com/docs/81011/tsal6400.pdf; ComponentLink1Description: http://www.vishay.com/docs/81011/tsal6400.pdf; Supplier Part Number 1: 751-1205-ND
Q1 = TRAN_PCHANNEL_MOSFET_SI2307_SMD_TO236: MOSFET P-CH 30V 3.5A SOT23-3; Manufacturer: Vishay Siliconix; Manufacturer Part Number: SI2307CDS-T1-GE3; FET Type: MOSFET P-Channel, Metal Oxide; FET Feature: Standard; Current - Continuous Drain (Id) @ 25°C: 3.5A (Tc); Rds On (Max) @ Id, Vgs: 88 mOhm @ 3.5A, 10V; Vgs(th) (Max) @ Id: 3V @ 250µA; Gate Charge (Qg) @ Vgs: 6.2nC @ 4.5V; Input Capacitance (Ciss) @ Vds: 340pF @ 15V; Power - Max: 1.8W; Supplier 1: Digi-Key; RoHS: RoHS Compliant; Category: Discrete Semiconductor Products; Stock 1: 12000; Pricing 1: 3000=0.13695, 6000=0.12865, 15000=0.12035, 30000=0.11039, 75000=0.10624, 150000=0.10209 (USD); Packaging: Tape & Reel (TR); Part Status: Active; Drain to Source Voltage (Vdss): 30V; Operating Temperature: -55°C ~ 150°C (TJ); Mounting Type: Surface Mount; Package / Case: TO-236-3, SC-59, SOT-23-3; Supplier Device Package: SOT-23-3 (TO-236); ComponentLink1URL: http://www.vishay.com/docs/68768/si2307cd.pdf; ComponentLink1Description: http://www.vishay.com/docs/68768/si2307cd.pdf; Supplier Part Number 1: SI2307CDS-T1-GE3TR-ND
Q2 = TRAN_NCHANNEL_MOSFET_SI2308_SMD_SOT23-3: MOSFET N-CH 60V 2.3A SOT23-3; Manufacturer: Vishay Siliconix; Manufacturer Part Number: SI2308BDS-T1-GE3; FET Type: MOSFET N-Channel, Metal Oxide; FET Feature: Standard; Current - Continuous Drain (Id) @ 25°C: 2.3A (Tc); Rds On (Max) @ Id, Vgs: 156 mOhm @ 1.9A, 10V; Vgs(th) (Max) @ Id: 3V @ 250µA; Gate Charge (Qg) @ Vgs: 6.8nC @ 10V; Input Capacitance (Ciss) @ Vds: 190pF @ 30V; Power - Max: 1.66W; Supplier 1: Digi-Key; RoHS: RoHS Compliant; Category: Discrete Semiconductor Products; Stock 1: 18000; Pricing 1: 3000=0.1488, 6000=0.1392, 15000=0.1296, 30000=0.12288, 75000=0.12, 150000=0.1152 (USD); Packaging: Tape & Reel (TR); Part Status: Active; Drain to Source Voltage (Vdss): 60V; Operating Temperature: -55°C ~ 150°C (TJ); Mounting Type: Surface Mount; Package / Case: TO-236-3, SC-59, SOT-23-3; Supplier Device Package: SOT-23-3 (TO-236); ComponentLink1URL: http://www.vishay.com/docs/69958/si2308bd.pdf; ComponentLink1Description: http://www.vishay.com/docs/69958/si2308bd.pdf; Supplier Part Number 1: SI2308BDS-T1-GE3TR-ND
Q3 = TRAN_7NPN_SMD_16SOIC: TRANS 7NPN DARL 50V 0.5A 16SO; Manufacturer: Texas Instruments; Manufacturer Part Number: ULN2003ADR; Transistor Type: 7 NPN Darlington; Current - Collector (Ic) (Max): 500mA; Vce Saturation (Max) @ Ib, Ic: 1.6V @ 500µA, 350mA; Supplier 1: Digi-Key; RoHS: RoHS Compliant; Category: Discrete Semiconductor Products; Stock 1: 35000; Pricing 1: 2500=0.186, 5000=0.174, 12500=0.162, 25000=0.1536, 62500=0.15 (USD); Packaging: Tape & Reel (TR); Part Status: Active; Voltage - Collector Emitter Breakdown (Max): 50V; Current - Collector Cutoff (Max): -; DC Current Gain (hFE) (Min) @ Ic, Vce: -; Power - Max: -; Frequency - Transition: -; Mounting Type: Surface Mount; Package / Case: 16-SOIC (0.154", 3.90mm Width); Supplier Device Package: 16-SOIC; ComponentLink1URL: http://www.ti.com/lit/ds/symlink/uln2003a.pdf; ComponentLink1Description: http://www.ti.com/lit/ds/symlink/uln2003a.pdf; Supplier Part Number 1: 296-1368-2-ND
Q4 = TRAN_NPN_SMD_SOT23_0.2A_40V: TRANS NPN 40V 0.2A SOT23; Manufacturer: ON Semiconductor; Manufacturer Part Number: MMBT3904LT1G; Current - Collector (Ic) (Max): 200mA; Vce Saturation (Max) @ Ib, Ic: 300mV @ 5mA, 50mA; DC Current Gain (hFE) (Min) @ Ic, Vce: 100 @ 10mA, 1V; Power - Max: 300mW; Frequency - Transition: 300MHz; Supplier 1: Digi-Key; RoHS: RoHS Compliant; Category: Discrete Semiconductor Products; Stock 1: 540000; Pricing 1: 3000=0.01913, 6000=0.01725, 15000=0.015, 30000=0.0135, 75000=0.012, 150000=0.00998 (USD); Packaging: Tape & Reel (TR); Part Status: Active; Transistor Type: NPN; Voltage - Collector Emitter Breakdown (Max): 40V; Current - Collector Cutoff (Max): -; Mounting Type: Surface Mount; Package / Case: TO-236-3, SC-59, SOT-23-3; Supplier Device Package: SOT-23-3 (TO-236); ComponentLink1URL: http://www.onsemi.com/pub_link/Collateral/MMBT3904LT1-D.PDF; ComponentLink1Description: http://www.onsemi.com/pub_link/Collateral/MMBT3904LT1-D.PDF; Supplier Part Number 1: MMBT3904LT1GOSTR-ND
R9 = R_10K_SMD0603_1%_1/10W: as R1 on sheet [03] - MODULE BLE; Supplier 1: Digi-Key; RoHS: RoHS Compliant; Category: Resistors; Stock 1: 10005000; Pricing 1: 5000=0.00167, 10000=0.00145, 25000=0.00128, 50000=0.00117, 125000=0.00115 (USD); Packaging: Tape & Reel (TR); Part Status: Active; Tolerance: ±1%; Composition: Thick Film; Features: Moisture Resistant; Operating Temperature: -55°C ~ 155°C; Package / Case: 0603 (1608 Metric); Supplier Device Package: 0603; Size / Dimension: 0.063" L x 0.031" W (1.60mm x 0.80mm); Height: 0.022" (0.55mm); Number of Terminations: 2; ComponentLink1URL: http://www.yageo.com/documents/recent/PYu-RC_Group_51_RoHS_L_04.pdf; ComponentLink1Description: http://www.yageo.com/documents/recent/PYu-RC_Group_51_RoHS_L_04.pdf; Supplier Part Number 1: 311-10.0KHRTR-ND; Mounting Type: Surface Mount, MLCC; Applications: General Purpose; Ratings: -; Height - Seated (Max): -; Thickness (Max): 0.037" (0.94mm); Lead Spacing: -; Lead Style: -; ComponentLink2URL: http://datasheets.avx.com/X7RDielectric.pdf; ComponentLink2Description: http://datasheets.avx.com/X7RDielectric.pdf
R10 R11 = R_100K_SMD0603_1%_1/10W: RES SMD 100K OHM 1% 1/10W 0603; Manufacturer: Yageo; Manufacturer Part Number: RC0603FR-07100KL; Power (Watts): 0.1W, 1/10W; Temperature Coefficient: ±100ppm/°C; Supplier 1: Digi-Key; RoHS: RoHS Compliant; Category: Resistors; Stock 1: 8585000; Pricing 1: 5000=0.00167, 10000=0.00145, 25000=0.00128, 50000=0.00117, 125000=0.00115 (USD); Packaging: Tape & Reel (TR); Part Status: Active; Tolerance: ±1%; Composition: Thick Film; Features: Moisture Resistant; Operating Temperature: -55°C ~ 155°C; Package / Case: 0603 (1608 Metric); Supplier Device Package: 0603; Size / Dimension: 0.063" L x 0.031" W (1.60mm x 0.80mm); Height: 0.022" (0.55mm); Number of Terminations: 2; ComponentLink1URL: http://www.yageo.com/documents/recent/PYu-RC_Group_51_RoHS_L_04.pdf; ComponentLink1Description: http://www.yageo.com/documents/recent/PYu-RC_Group_51_RoHS_L_04.pdf; Supplier Part Number 1: 311-100KHRTR-ND
R12 = R_22K_SMD0603_1%_1/10W: RES SMD 22K OHM 1% 1/10W 0603; Manufacturer: Yageo; Manufacturer Part Number: RC0603FR-0722KL; Power (Watts): 0.1W, 1/10W; Temperature Coefficient: ±100ppm/°C; Supplier 1: Digi-Key; RoHS: RoHS Compliant; Category: Resistors; Stock 1: 2610236; Pricing 1: 1=0.1, 10=0.014, 25=0.01, 100=0.0057, 250=0.00436, 500=0.00348, 1000=0.00257, 2500=0.00223 (USD); Packaging: Cut Tape (CT); Part Status: Active; Tolerance: ±1%; Composition: Thick Film; Features: Moisture Resistant; Operating Temperature: -55°C ~ 155°C; Package / Case: 0603 (1608 Metric); Supplier Device Package: 0603; Size / Dimension: 0.063" L x 0.031" W (1.60mm x 0.80mm); Height: 0.022" (0.55mm); Number of Terminations: 2; ComponentLink1URL: http://www.yageo.com/documents/recent/PYu-RC_Group_51_RoHS_L_04.pdf; ComponentLink1Description: http://www.yageo.com/documents/recent/PYu-RC_Group_51_RoHS_L_04.pdf; Supplier Part Number 1: 311-22.0KHRCT-ND
R13-R17 = R_1OhM_SMD0603_1%_1/4W: RES SMD 1 OHM 1% 1/4W 0603; Manufacturer: Panasonic Electronic Components; Manufacturer Part Number: ERJ-3BQF1R0V; Power (Watts): 0.25W, 1/4W; Temperature Coefficient: ±200ppm/°C; Supplier 1: Digi-Key; RoHS: RoHS Compliant; Category: Resistors; Stock 1: 5000; Pricing 1: 5000=0.0408, 10000=0.03808, 25000=0.03618, 50000=0.03544, 125000=0.03468 (USD); Packaging: Tape & Reel (TR); Part Status: Active; Tolerance: ±1%; Composition: Thick Film; Features: Automotive AEC-Q200, Current Sense; Operating Temperature: -55°C ~ 125°C; Package / Case: 0603 (1608 Metric); Supplier Device Package: 0603; Size / Dimension: 0.063" L x 0.031" W (1.60mm x 0.80mm); Height: 0.022" (0.55mm); Number of Terminations: 2; ComponentLink1URL: https://industrial.panasonic.com/cdbs/www-data/pdf/RDA0000/AOA0000C239.pdf; ComponentLink1Description: https://industrial.panasonic.com/cdbs/www-data/pdf/RDA0000/AOA0000C239.pdf; Supplier Part Number 1: P17371TR-ND
R18 = R_1K_SMD0603_1%_1/10W: RES SMD 1K OHM 1% 1/10W 0603; Manufacturer: Yageo; Manufacturer Part Number: RC0603FR-071KL; Power (Watts): 0.1W, 1/10W; Temperature Coefficient: ±100ppm/°C; Supplier 1: Digi-Key; RoHS: RoHS Compliant; Category: Resistors; Stock 1: 6725000; Pricing 1: 5000=0.00167, 10000=0.00145, 25000=0.00128, 50000=0.00117, 125000=0.00115 (USD); Packaging: Tape & Reel (TR); Part Status: Active; Tolerance: ±1%; Composition: Thick Film; Features: Moisture Resistant; Operating Temperature: -55°C ~ 155°C; Package / Case: 0603 (1608 Metric); Supplier Device Package: 0603; Size / Dimension: 0.063" L x 0.031" W (1.60mm x 0.80mm); Height: 0.022" (0.55mm); Number of Terminations: 2; ComponentLink1URL: http://www.yageo.com/documents/recent/PYu-RC_Group_51_RoHS_L_04.pdf; ComponentLink1Description: http://www.yageo.com/documents/recent/PYu-RC_Group_51_RoHS_L_04.pdf; Supplier Part Number 1: 311-1.00KHRTR-ND

## Nets that join several sheets
GND: [03] - MODULE BLE (9 pins), [05] - POWER (9 pins), [06] - PERIPHERAL (9 pins)
VCC: [03] - MODULE BLE (9 pins), [05] - POWER (C11.1 C15.1 R5.2 U3.5), [06] - PERIPHERAL (C18.1 J3.1 L2.3 L8.1)
VCC_PIN: [05] - POWER (C16.1 J1.2 J2.1 U4.5), [06] - PERIPHERAL (8 pins)
BLE_ADC_BAT: [03] - MODULE BLE (U1.10), [06] - PERIPHERAL (C19.1 R11.1 R12.2)
BLE_CHRG: [03] - MODULE BLE (U1.12), [05] - POWER (D5.2 U4.7)
BLE_LED3W: [03] - MODULE BLE (U1.31), [06] - PERIPHERAL (J3.3 R18.1)
BLE_MEASURE_BAT: [03] - MODULE BLE (U1.21), [06] - PERIPHERAL (Q2.1 R10.2)
BLE_STDBY: [03] - MODULE BLE (U1.11), [05] - POWER (D6.2 U4.6)